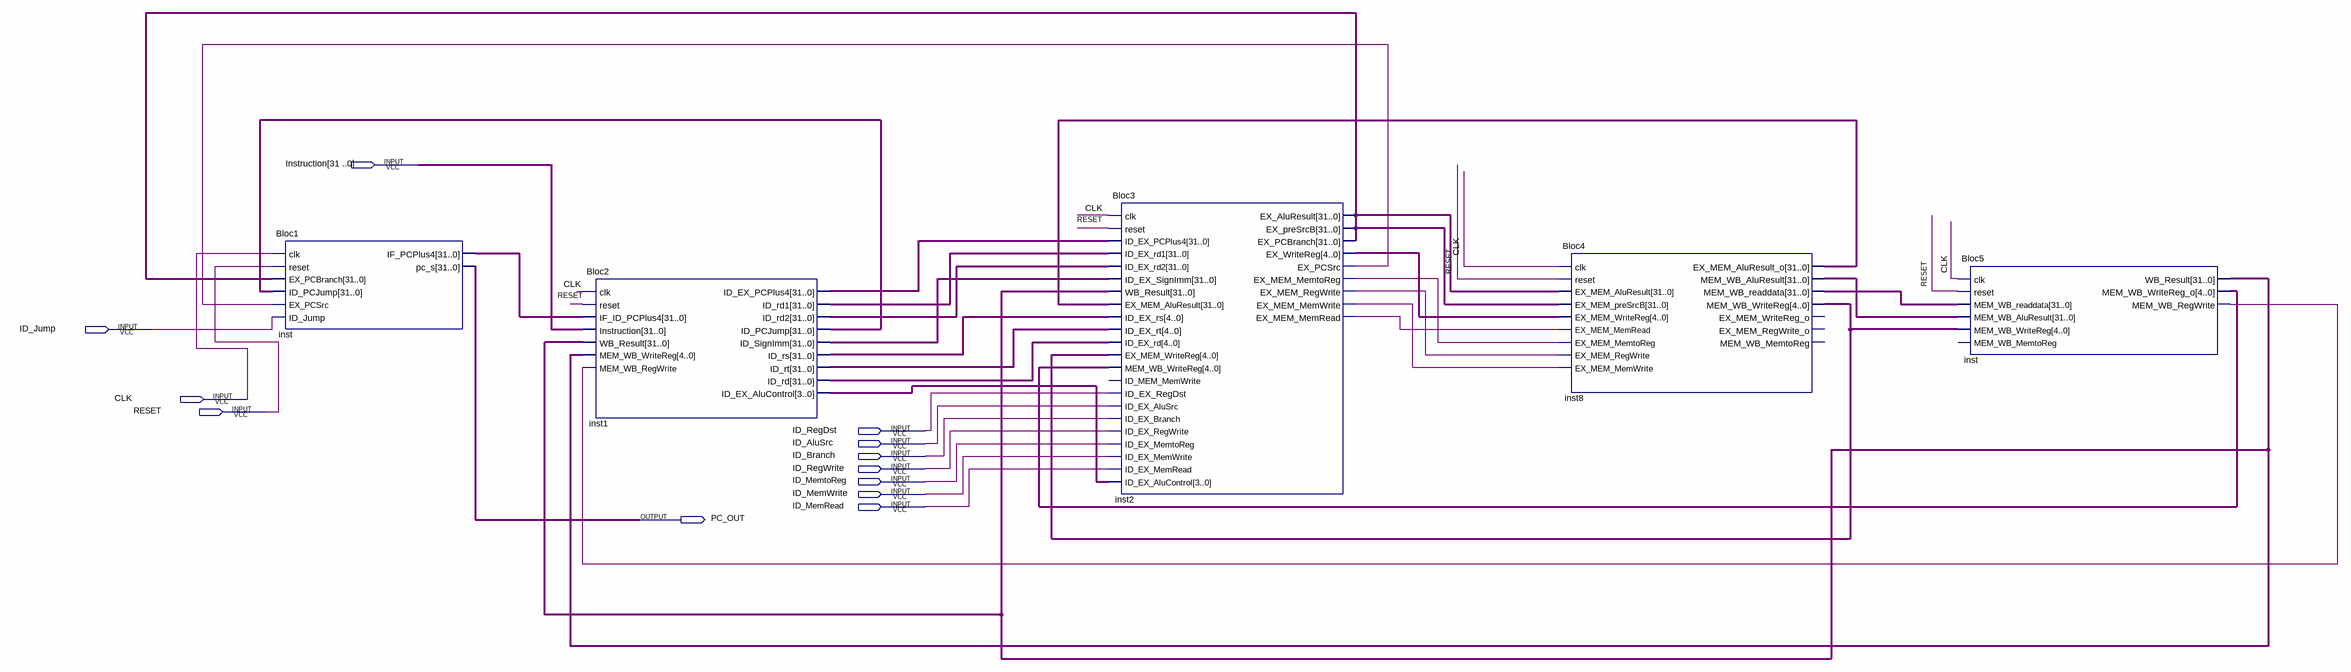
[diagram p0: schematic sheet]
// Quartus schematic Test_Plan_Quartus.bdf as structural Verilog: 5 symbols, 12 pins
module Test_Plan_Quartus (
  input  [31:0] Instruction,
  input  ID_Jump,
  input  CLK,
  input  RESET,
  input  ID_RegDst,
  input  ID_AluSrc,
  input  ID_Branch,
  input  ID_RegWrite,
  input  ID_MemtoReg,
  input  ID_MemWrite,
  input  ID_MemRead,
  output PC_OUT
);

  wire inst2_ex_mem_memread, inst2_ex_mem_memtoreg, inst2_ex_mem_memwrite, inst2_ex_mem_regwrite,
       inst2_ex_pcsrc, inst_mem_wb_regwrite;
  wire [3:0] inst1_id_ex_alucontrol;
  wire [4:0] inst2_ex_writereg, inst8_mem_wb_writereg, inst_mem_wb_writereg_o;
  wire [31:0] inst1_id_ex_pcplus4, inst1_id_pcjump, inst1_id_rd, inst1_id_rd1, inst1_id_rd2, inst1_id_rs,
       inst1_id_rt, inst1_id_signimm, inst2_ex_aluresult, inst8_ex_mem_aluresult_o, inst8_mem_wb_aluresult,
       inst8_mem_wb_readdata, inst_if_pcplus4, inst_pc_s, inst_wb_result;

  Bloc1 inst (
    .clk(CLK), .reset(RESET), .EX_PCBranch(inst2_ex_aluresult), .ID_PCJump(inst1_id_pcjump),
    .EX_PCSrc(inst2_ex_pcsrc), .ID_Jump(ID_Jump), .IF_PCPlus4(inst_if_pcplus4), .pc_s(inst_pc_s));
  Bloc2 inst1 (
    .clk(CLK), .reset(RESET), .IF_ID_PCPlus4(inst_if_pcplus4), .Instruction(Instruction),
    .WB_Result(inst_wb_result), .MEM_WB_WriteReg(inst_wb_result), .MEM_WB_RegWrite(inst_mem_wb_regwrite),
    .ID_EX_PCPlus4(inst1_id_ex_pcplus4), .ID_rd1(inst1_id_rd1), .ID_rd2(inst1_id_rd2),
    .ID_PCJump(inst1_id_pcjump), .ID_SignImm(inst1_id_signimm), .ID_rs(inst1_id_rs), .ID_rt(inst1_id_rt),
    .ID_rd(inst1_id_rd), .ID_EX_AluControl(inst1_id_ex_alucontrol));
  Bloc3 inst2 (
    .clk(CLK), .reset(RESET), .ID_EX_PCPlus4(inst1_id_ex_pcplus4), .ID_EX_rd1(inst1_id_rd1),
    .ID_EX_rd2(inst1_id_rd2), .ID_EX_SignImm(inst1_id_signimm), .WB_Result(inst_wb_result),
    .EX_MEM_AluResult(inst8_ex_mem_aluresult_o), .ID_EX_rs(inst1_id_rs), .ID_EX_rt(inst1_id_rt),
    .ID_EX_rd(inst1_id_rd), .EX_MEM_WriteReg(inst8_mem_wb_writereg),
    .MEM_WB_WriteReg(inst_mem_wb_writereg_o), .ID_EX_RegDst(ID_RegDst), .ID_EX_AluSrc(ID_AluSrc),
    .ID_EX_Branch(ID_Branch), .ID_EX_RegWrite(ID_RegWrite), .ID_EX_MemtoReg(ID_MemtoReg),
    .ID_EX_MemWrite(ID_MemWrite), .ID_EX_MemRead(ID_MemRead), .ID_EX_AluControl(inst1_id_ex_alucontrol),
    .EX_AluResult(inst2_ex_aluresult), .EX_preSrcB(inst2_ex_aluresult), .EX_PCBranch(inst2_ex_aluresult),
    .EX_WriteReg(inst2_ex_writereg), .EX_PCSrc(inst2_ex_pcsrc), .EX_MEM_MemtoReg(inst2_ex_mem_memtoreg),
    .EX_MEM_RegWrite(inst2_ex_mem_regwrite), .EX_MEM_MemWrite(inst2_ex_mem_memwrite),
    .EX_MEM_MemRead(inst2_ex_mem_memread));  // open: ID_MEM_MemWrite
  Bloc4 inst8 (
    .clk(CLK), .reset(RESET), .EX_MEM_AluResult(inst2_ex_aluresult), .EX_MEM_preSrcB(inst2_ex_aluresult),
    .EX_MEM_WriteReg(inst2_ex_writereg), .EX_MEM_MemRead(inst2_ex_mem_memread),
    .EX_MEM_MemtoReg(inst2_ex_mem_memtoreg), .EX_MEM_RegWrite(inst2_ex_mem_regwrite),
    .EX_MEM_MemWrite(inst2_ex_mem_memwrite), .EX_MEM_AluResult_o(inst8_ex_mem_aluresult_o),
    .MEM_WB_AluResult(inst8_mem_wb_aluresult), .MEM_WB_readdata(inst8_mem_wb_readdata),
    .MEM_WB_WriteReg(inst8_mem_wb_writereg));  // open: EX_MEM_WriteReg_o, EX_MEM_RegWrite_o, MEM_WB_MemtoReg
  Bloc5 inst_dup2 (
    .clk(CLK), .reset(RESET), .MEM_WB_readdata(inst8_mem_wb_readdata),
    .MEM_WB_AluResult(inst8_mem_wb_aluresult), .MEM_WB_WriteReg(inst8_mem_wb_writereg),
    .WB_Result(inst_wb_result), .MEM_WB_WriteReg_o(inst_mem_wb_writereg_o),
    .MEM_WB_RegWrite(inst_mem_wb_regwrite));  // open: MEM_WB_MemtoReg
endmodule
